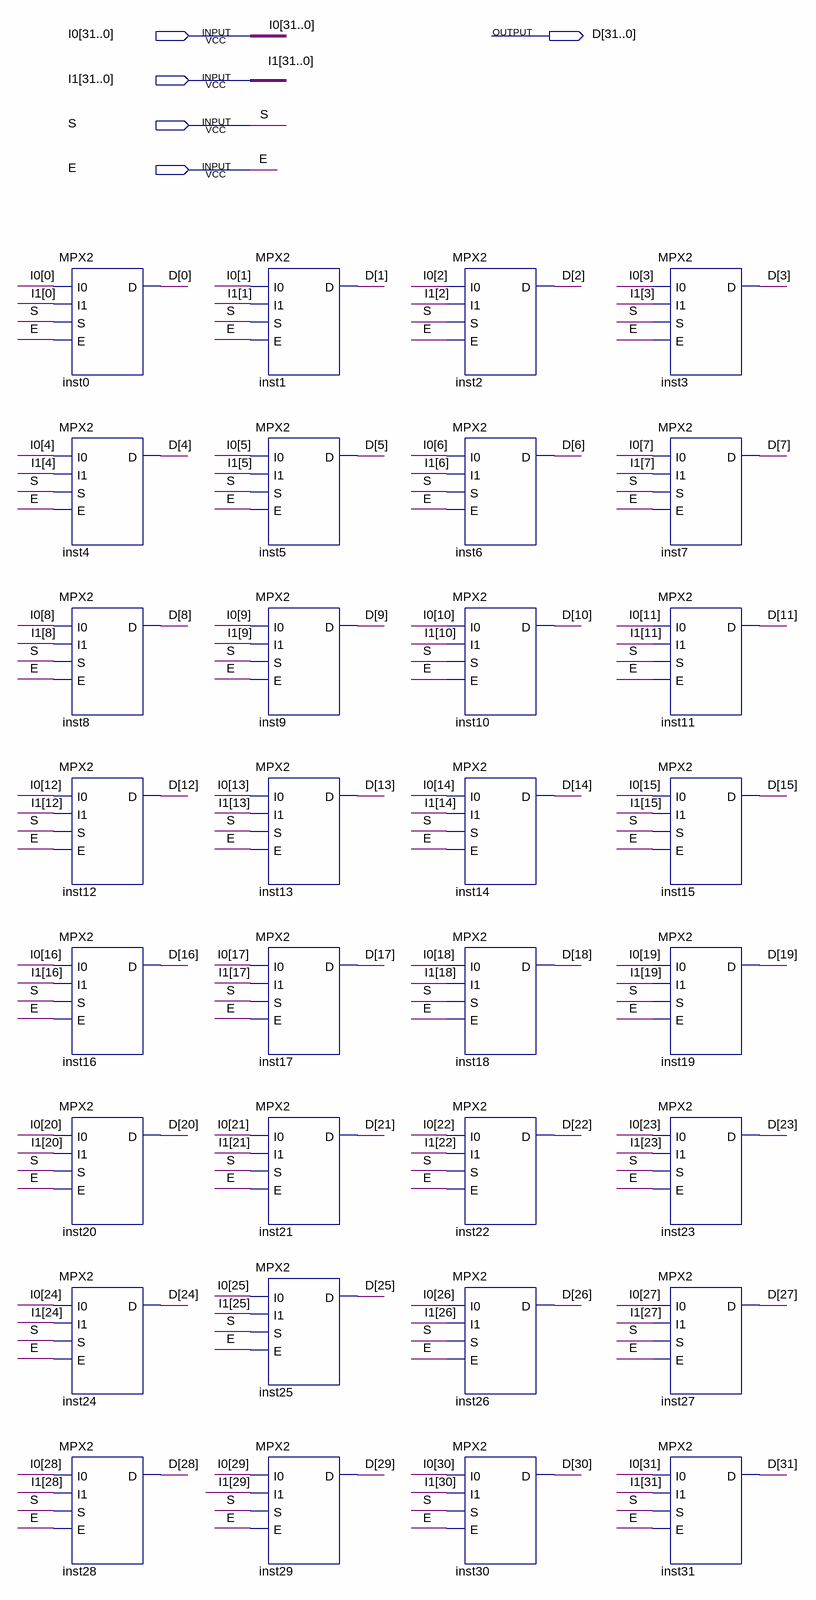
[diagram p0: schematic sheet]
// Quartus schematic MPX2_32BIT.bdf as structural Verilog: 32 symbols, 5 pins
module MPX2_32BIT (
  input  [31:0] I0,
  input  [31:0] I1,
  input  S,
  input  E,
  output [31:0] D
);

  MPX2 inst0 (.I0(I0[0]), .I1(I1[0]), .S(S), .E(E), .D(D[0]));
  MPX2 inst4 (.I0(I0[4]), .I1(I1[4]), .S(S), .E(E), .D(D[4]));
  MPX2 inst8 (.I0(I0[8]), .I1(I1[8]), .S(S), .E(E), .D(D[8]));
  MPX2 inst12 (.I0(I0[12]), .I1(I1[12]), .S(S), .E(E), .D(D[12]));
  MPX2 inst16 (.I0(I0[16]), .I1(I1[16]), .S(S), .E(E), .D(D[16]));
  MPX2 inst20 (.I0(I0[20]), .I1(I1[20]), .S(S), .E(E), .D(D[20]));
  MPX2 inst24 (.I0(I0[24]), .I1(I1[24]), .S(S), .E(E), .D(D[24]));
  MPX2 inst28 (.I0(I0[28]), .I1(I1[28]), .S(S), .E(E), .D(D[28]));
  MPX2 inst1 (.I0(I0[1]), .I1(I1[1]), .S(S), .E(E), .D(D[1]));
  MPX2 inst5 (.I0(I0[5]), .I1(I1[5]), .S(S), .E(E), .D(D[5]));
  MPX2 inst9 (.I0(I0[9]), .I1(I1[9]), .S(S), .E(E), .D(D[9]));
  MPX2 inst13 (.I0(I0[13]), .I1(I1[13]), .S(S), .E(E), .D(D[13]));
  MPX2 inst17 (.I0(I0[17]), .I1(I1[17]), .S(S), .E(E), .D(D[17]));
  MPX2 inst21 (.I0(I0[21]), .I1(I1[21]), .S(S), .E(E), .D(D[21]));
  MPX2 inst25 (.I0(I0[25]), .I1(I1[25]), .S(S), .E(E), .D(D[25]));
  MPX2 inst29 (.I0(I0[29]), .I1(I1[29]), .S(S), .E(E), .D(D[29]));
  MPX2 inst2 (.I0(I0[2]), .I1(I1[2]), .S(S), .E(E), .D(D[2]));
  MPX2 inst6 (.I0(I0[6]), .I1(I1[6]), .S(S), .E(E), .D(D[6]));
  MPX2 inst10 (.I0(I0[10]), .I1(I1[10]), .S(S), .E(E), .D(D[10]));
  MPX2 inst14 (.I0(I0[14]), .I1(I1[14]), .S(S), .E(E), .D(D[14]));
  MPX2 inst18 (.I0(I0[18]), .I1(I1[18]), .S(S), .E(E), .D(D[18]));
  MPX2 inst22 (.I0(I0[22]), .I1(I1[22]), .S(S), .E(E), .D(D[22]));
  MPX2 inst26 (.I0(I0[26]), .I1(I1[26]), .S(S), .E(E), .D(D[26]));
  MPX2 inst30 (.I0(I0[30]), .I1(I1[30]), .S(S), .E(E), .D(D[30]));
  MPX2 inst3 (.I0(I0[3]), .I1(I1[3]), .S(S), .E(E), .D(D[3]));
  MPX2 inst7 (.I0(I0[7]), .I1(I1[7]), .S(S), .E(E), .D(D[7]));
  MPX2 inst11 (.I0(I0[11]), .I1(I1[11]), .S(S), .E(E), .D(D[11]));
  MPX2 inst15 (.I0(I0[15]), .I1(I1[15]), .S(S), .E(E), .D(D[15]));
  MPX2 inst19 (.I0(I0[19]), .I1(I1[19]), .S(S), .E(E), .D(D[19]));
  MPX2 inst23 (.I0(I0[23]), .I1(I1[23]), .S(S), .E(E), .D(D[23]));
  MPX2 inst27 (.I0(I0[27]), .I1(I1[27]), .S(S), .E(E), .D(D[27]));
  MPX2 inst31 (.I0(I0[31]), .I1(I1[31]), .S(S), .E(E), .D(D[31]));
endmodule
